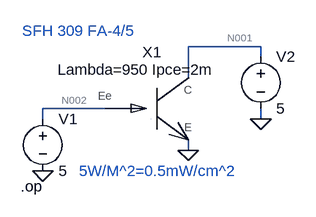
[diagram p0: schematic testSFH309FA.asc]
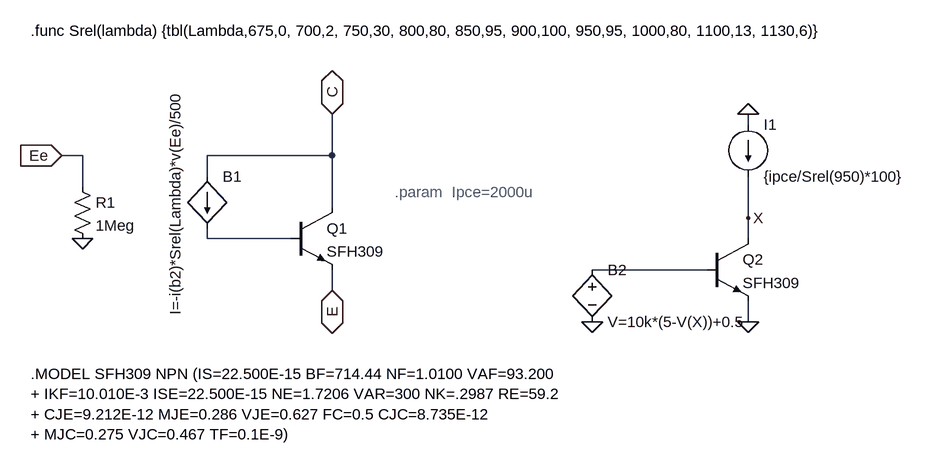
[diagram p1: sub-circuit sfh309fa.asc]
testSFH309FA.asc, the LTspice schematic file:
Version 4
SHEET 1 1348 680
WIRE 672 -240 624 -240
WIRE 736 -240 672 -240
WIRE 736 -224 736 -240
WIRE 624 -192 624 -240
WIRE 496 -144 400 -144
WIRE 400 -128 400 -144
WIRE 736 -128 736 -144
WIRE 624 -80 624 -96
FLAG 400 -48 0
FLAG 624 -80 0
FLAG 736 -128 0
DATAFLAG 672 -240 "-I(V2)"
SYMBOL SFH309FA 560 -176 R0
WINDOW 39 -16 -13 Bottom 2
SYMATTR InstName X1
SYMATTR SpiceLine Lambda=950 Ipce=2m
SYMBOL voltage 400 -144 R0
WINDOW 123 0 0 Left 2
WINDOW 39 0 0 Left 2
SYMATTR InstName V1
SYMATTR Value 5
SYMBOL voltage 736 -240 R0
WINDOW 123 0 0 Left 2
WINDOW 39 0 0 Left 2
SYMATTR InstName V2
SYMATTR Value 5
TEXT 366 -24 Left 2 !.op
TEXT 368 -264 Left 2 ;SFH 309 FA-4/5
TEXT 456 -48 Left 2 ;5W/M^2=0.5mW/cm^2

sfh309fa.asc, the sub-circuit schematic file:
Version 4
SHEET 1 1664 680
WIRE 864 -384 864 -400
WIRE -160 -336 -192 -336
WIRE 224 -336 224 -400
WIRE 224 -336 32 -336
WIRE 32 -304 32 -336
WIRE -160 -288 -160 -336
WIRE 224 -256 224 -336
WIRE 864 -240 864 -304
WIRE 32 -208 32 -224
WIRE 160 -208 32 -208
WIRE 864 -208 864 -240
WIRE 800 -160 624 -160
WIRE 224 -128 224 -160
WIRE 864 -80 864 -112
FLAG -160 -208 0
FLAG -192 -336 Ee
IOPIN -192 -336 In
FLAG 224 -400 C
IOPIN 224 -400 BiDir
FLAG 224 -128 E
IOPIN 224 -128 BiDir
FLAG 864 -400 0
FLAG 864 -80 0
FLAG 624 -80 0
FLAG 864 -240 X
SYMBOL npn 160 -256 R0
SYMATTR InstName Q1
SYMATTR Value SFH309
SYMBOL bi 32 -304 R0
WINDOW 3 -49 -134 VRight 2
SYMATTR Value I=-i(b2)*Srel(Lambda)*v(Ee)/500
SYMATTR InstName B1
SYMBOL res -176 -304 R0
SYMATTR InstName R1
SYMATTR Value 1Meg
SYMBOL npn 800 -208 R0
SYMATTR InstName Q2
SYMATTR Value SFH309
SYMBOL current 864 -384 R0
SYMATTR InstName I1
SYMATTR Value {ipce/Srel(950)*100}
SYMBOL bv 624 -176 R0
SYMATTR InstName B2
SYMATTR Value V=10k*(5-V(X))+0.5
TEXT -240 0 Left 2 !.MODEL SFH309 NPN (IS=22.500E-15 BF=714.44 NF=1.0100 VAF=93.200\n+ IKF=10.010E-3 ISE=22.500E-15 NE=1.7206 VAR=300 NK=.2987 RE=59.2\n+ CJE=9.212E-12 MJE=0.286 VJE=0.627 FC=0.5 CJC=8.735E-12\n+ MJC=0.275 VJC=0.467 TF=0.1E-9)
TEXT -240 -528 Left 2 !.func Srel(lambda) {tbl(Lambda,675,0, 700,2, 750,30, 800,80, 850,95, 900,100, 950,95, 1000,80, 1100,13, 1130,6)}
TEXT 320 -280 Left 2 ;.param  Ipce=2000u

The netlist it stands for:
* testSFH309FA.asc
XX1 N002 N001 0 sfh309fa params: Lambda=950 Ipce=2m
V1 N002 0 5
V2 N001 0 5

* block symbol definitions
.subckt sfh309fa Ee C E
Q1 C N001 E 0 SFH309
B1 C N001 I=-i(b2)*Srel(Lambda)*v(Ee)/500
R1 Ee 0 1Meg
Q2 X N002 0 0 SFH309
I1 0 X {ipce/Srel(950)*100}
B2 N002 0 V=10k*(5-V(X))+0.5
.MODEL SFH309 NPN (IS=22.500E-15 BF=714.44 NF=1.0100 VAF=93.200
+ IKF=10.010E-3 ISE=22.500E-15 NE=1.7206 VAR=300 NK=.2987 RE=59.2
+ CJE=9.212E-12 MJE=0.286 VJE=0.627 FC=0.5 CJC=8.735E-12
+ MJC=0.275 VJC=0.467 TF=0.1E-9)
.func Srel(lambda) {tbl(Lambda,675,0, 700,2, 750,30, 800,80, 850,95, 900,100, 950,95, 1000,80, 1100,13, 1130,6)}
* .param  Ipce=2000u
.ends sfh309fa

.model NPN NPN
.model PNP PNP
.lib standard.bjt
.op
* SFH 309 FA-4/5
* 5W/M^2=0.5mW/cm^2
.backanno
.end

* Results of the author's LTspice run, read from the files saved beside the schematic
* Operating Point:
*   V(n001) = 5 V
*   V(n002) = 5 V
*   I(V2) = -2.01 mA
*   I(V1) = -5 µA
*   Ix(x1:EE) = 5 µA
*   Ix(x1:C) = 2.01 mA
*   Ix(x1:E) = -2.01 mA
* From the log:
*   Semiconductor Device Operating Points:
*                           --- Bipolar Transistors ---
*   Name:     q:x1:2      q:x1:1
*   Model:   x1:sfh309   x1:sfh309
*   Ib:       3.19e-06    3.03e-06
*   Ic:       2.11e-03    2.01e-03
*   Vbe:      7.86e-01    7.79e-01
*   Vbc:     -4.21e+00   -4.22e+00
*   Vce:      5.00e+00    5.00e+00
*   BetaDC:   6.61e+02    6.63e+02
*   Gm:       7.44e-02    7.11e-02
*   Rpi:      8.27e+03    8.71e+03
*   Rx:       0.00e+00    0.00e+00
*   Ro:       4.62e+04    4.84e+04
*   Cbe:      2.22e-11    2.19e-11
*   Cbc:      4.63e-12    4.63e-12
*   Cjs:      0.00e+00    0.00e+00
*   BetaAC:   6.15e+02    6.19e+02
*   Cbx:      0.00e+00    0.00e+00
*   Ft:       4.40e+08    4.26e+08